# Altium project STM32_min.PrjPcb
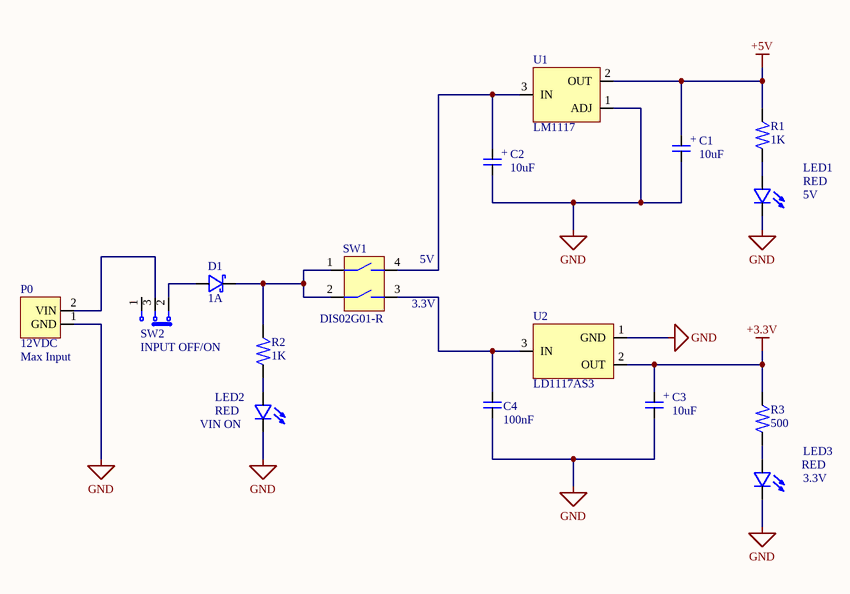
[diagram p0: STM32_Input.SchDoc]
5 sheets, 66 parts. Net scope: flat (ports and power ports of the same name join across sheets).
Board file: STM32_min.PcbDoc
Sheets:
  STM32_Input.SchDoc
  STM32_min.SchDoc
  STM32_Lvl-Shft_MCU.SchDoc
  STM32_Lvl-Shft_HUB75.SchDoc
  STM32_IO.SchDoc

## Sheet STM32_Input.SchDoc
size A; SheetNumber: 1; SheetTotal: 5

### Parts
C1  10uF  [SMT_CAP_EL_CHANG_VT1E100MC054000CE0]
C2  10uF  [SMT_CAP_EL_CHANG_VT1E100MC054000CE0]
C3  10uF  [SMT_CAP_EL_CHANG_VT1E100MC054000CE0]
C4  100nF  [SMT_CAP_1206(3216)_SAMSUNG]
D1  1A  [SMT_DIODE_SCHTKY_SMB_ONSEMI]
LED1  RED  [DIOM2012X18N]
LED2  RED  [DIOM2012X18N]
LED3  RED  [DIOM2012X18N]
P0  12VDC  [THT_CON_WAFER_2P_STRAIGHT_A2001WV2-2P]
R1  1K  [SMT_RES_0805(2012)]
R2  1K  [SMT_RES_0805(2012)]
R3  500  [SMT_RES_0805(2012)]
SW1  DIS02G01-R  [SMT_SWITCH_DIP_DIS02G01-R]
SW2  INPUT OFF/ON  [THT_SSW_ESP1010]
U1  LM1117  [SOT230P700X180-4N]
U2  LD1117AS3  [SMT_VR_LD1117AS3]

### Nets
+3.3V: C3.1 R3.2 U2.2(OUT)
+5V: C1.1 R1.2 U1.2(OUT)
GND: C1.2 C2.2 C3.2 C4.1 LED1.2 LED2.2 LED3.2 P0.1(GND) U1.1(ADJ) U2.1(GND)
NetC2_1: C2.1 SW1.4 U1.3(IN)
NetC4_2: C4.2 SW1.3 U2.3(IN)
NetD1_1: D1.1 SW2.2
NetD1_2: D1.2 R2.2 SW1.1 SW1.2
NetLED1_1: LED1.1 R1.1
NetLED2_1: LED2.1 R2.1
NetLED3_1: LED3.1 R3.1
NetP0_2: P0.2(VIN) SW2.3

Not connected (* = marked no-connect by the designer): SW2 1

### Notes on the sheet
- 5V
- (near SW1) 5V
- (near SW1) 3.3V
- (near P0) Max Input
- (near LED2) VIN ON
- 3.3V
- (in symbol SMT_CAP_EL_CHANG_VT1E100MC054000CE0) +

### Library data of the parts
C1-C3 = SMT_CAP_EL_CHANG_VT1E100MC054000CE0: SMT Capacitor Electrolytic 35V 10uF Pitch 1.3mm VT1E100MC054000CE0
C4 = SMT_CAP_1206(3216)_SAMSUNG: Ceramic Capacitor 1206(3216) Samsung CL31B104KBCNNNC 50VDC
D1 = SMT_DIODE_SCHTKY_SMB_ONSEMI: SMT Diode Schottky ONSEMI MODEL IF=1A VR=20V FV=0.6V MBRS120T3G
LED1-LED3 = SMT_LED_0805(2012): Led Diode 0805(2012) Cathode Mark, 20mA
P0 = THT_CON_WAFER_2P_STRAIGHT_A2001WV2-2P: Connector Wafer 2-Pins Pitch-2.0mm Straight Pins A2001WV2-2P
R1-R3 = SMT_RES_0805(2012): 0805(2012) Resistor 1/4-1/8W 150V 2A
SW1 = SMT_SWITCH_DIP_DIS02G01-R: DIP SMD Switch 2-Line 4-Pole 2.54Pitch Rating 25mA/24Vdc Height 0.70mm
SW2 = THT_SSW_ESP1010: Slide Switch ESP1010 12V 0.5A
U1 = LM1117_SOT-223: LM1117 SOT-223 5V HTC Voltage Regulator
U2 = SMT_VR_LD1117AS3: Voltage Regulator ST LD1117AS33TR 1A 3.3V 10Vmax

## Sheet STM32_min.SchDoc
size A; SheetNumber: 2; SheetTotal: 5
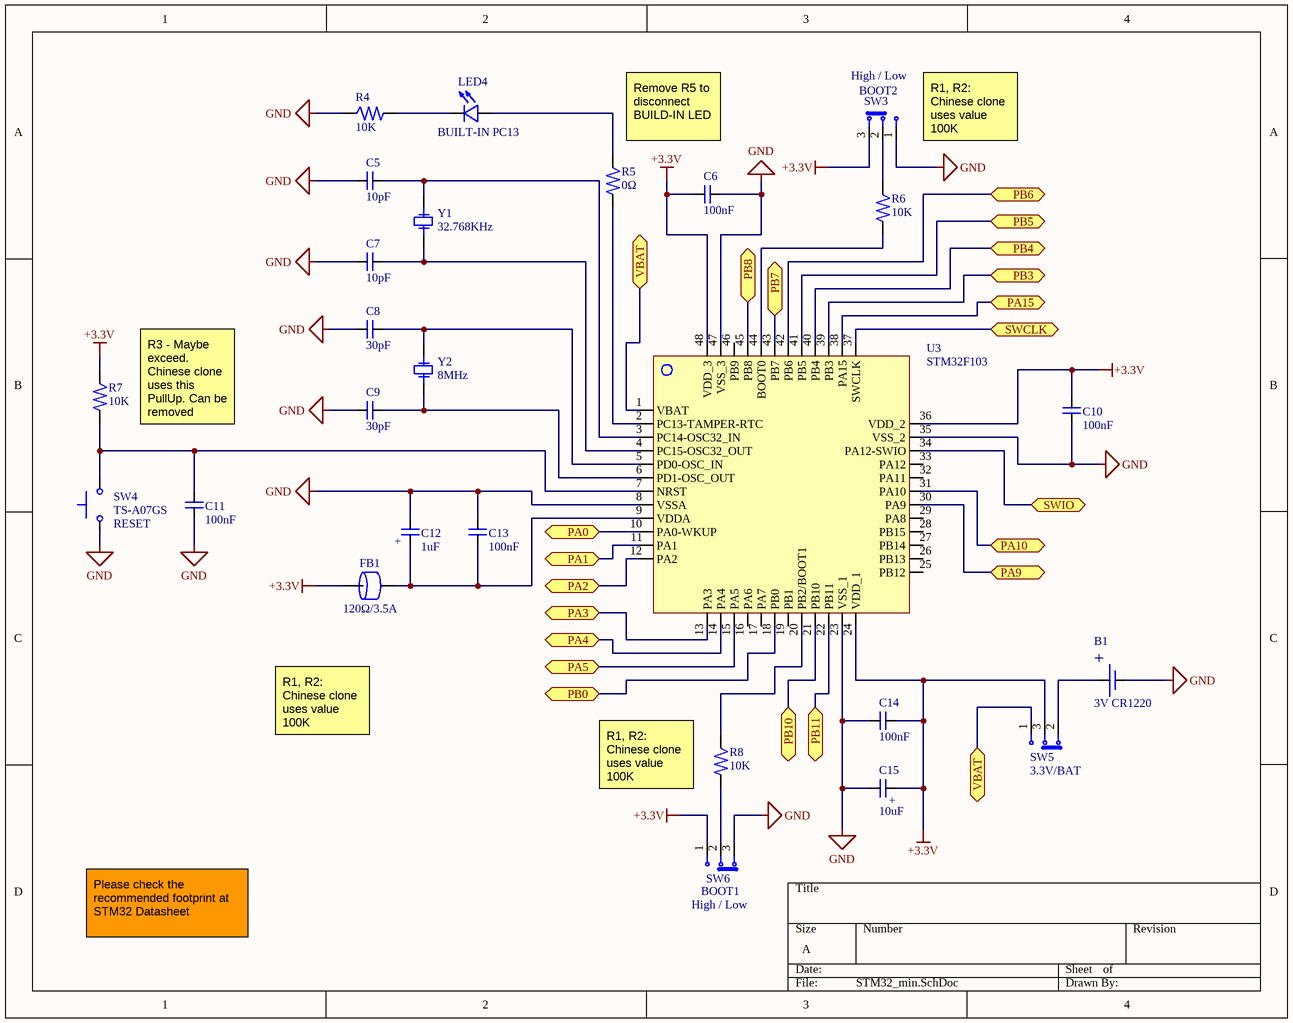
[diagram p1: STM32_min.SchDoc]

### Parts
B1  3V CR1220  [THT_BH-25T-GLD]
C5  10pF  [SMT_CAP_CER_MODEL_0805(2012)_SAMSUNG]
C6  100nF  [SMT_CAP_MODEL_1206(3216)_SAMSUNG]
C7  10pF  [SMT_CAP_CER_MODEL_0805(2012)_SAMSUNG]
C8  30pF  [SMT_CAP_MODEL_1206(3216)_SAMSUNG]
C9  30pF  [SMT_CAP_MODEL_1206(3216)_SAMSUNG]
C10  100nF  [SMT_CAP_MODEL_1206(3216)_SAMSUNG]
C11  100nF  [SMT_CAP_MODEL_1206(3216)_SAMSUNG]
C12  1uF  [SMT_CAP_TANT_MODEL_1206(3216)_KYOCERA]
C13  100nF  [SMT_CAP_MODEL_1206(3216)_SAMSUNG]
C14  100nF  [SMT_CAP_MODEL_1206(3216)_SAMSUNG]
C15  10uF  [SMT_CAP_TANT_MODEL_1210(3528)_KYOCERA]
FB1  120Ω/3.5A  [SMT_FERR_BEAD_MODEL_1206(3216)_MURATA]
LED4  BUILT-IN PC13  [DIOM2012X18N]
R4  10K  [SMT_RES_MODEL_1206(3216)_ROHM]
R5  0Ω  [SMT_RES_MODEL_1206(3216)_ROHM]
R6  10K  [SMT_RES_MODEL_1206(3216)_ROHM]
R7  10K  [SMT_RES_MODEL_1206(3216)_ROHM]
R8  10K  [SMT_RES_MODEL_1206(3216)_ROHM]
SW3  BOOT2  [SMT_SWW_SS-B90AP_DAWNING]
SW4  TS-A07GS  [SMT_TSW-A07GS]
SW5  3.3V/BAT  [THT_SSW_ESP1010]
SW6  BOOT1  [SMT_SWW_SS-B90AP_DAWNING]
U3  STM32F103  [SMT_IC_STM32F103]
Y1  32.768KHz  [SMT_XTAL_FC-135_EPSON]
Y2  8MHz  [SMT_XTAL_ATS08ASM-1E]

### Ports
PA0 (bidir), PA1 (bidir), PA2 (bidir), PA3 (bidir), PA4 (bidir), PA5 (bidir), PA9 (bidir), PA10 (bidir), PA15 (bidir), PB0 (bidir), PB3 (bidir), PB4 (bidir), PB5 (bidir), PB6 (bidir), PB7 (bidir), PB8 (bidir), PB10 (bidir), PB11 (bidir), SWCLK (bidir), SWIO (bidir), VBAT (bidir)

### Nets
+3.3V: C6.1 C10.1 C14.1 C15.1 FB1.1 R7.2 SW3.3 SW5.3 SW6.1 U3.24(VDD_1) U3.36(VDD_2) U3.48(VDD_3)
GND: B1.2(V-) C5.1 C6.2 C7.1 C8.1 C9.1 C10.2 C11.1 C12.2 C13.2 C14.2 C15.2 R4.2 SW3.1 SW4.1 SW6.3 U3.8(VSSA) U3.23(VSS_1) U3.35(VSS_2) U3.47(VSS_3)
NetB1_1: B1.1(V+) SW5.2
NetC5_2: C5.2 U3.3(PC14-OSC32_IN) Y1.2
NetC7_2: C7.2 U3.4(PC15-OSC32_OUT) Y1.1
NetC8_2: C8.2 U3.5(PD0-OSC_IN) Y2.2
NetC9_2: C9.2 U3.6(PD1-OSC_OUT) Y2.1
NetC11_2: C11.2 R7.1 SW4.2 U3.7(NRST)
NetC12_1: C12.1 C13.1 FB1.2 U3.9(VDDA)
NetIC1_1: U3.21(PB10) ; port PB10
NetIC1_3: U3.22(PB11) ; port PB11
NetIC1_4: U3.30(PA9) ; port PA9
NetIC1_5: U3.31(PA10) ; port PA10
NetIC2_1: U3.10(PA0-WKUP) ; port PA0
NetIC2_3: U3.12(PA2) ; port PA2
NetIC2_4: U3.13(PA3) ; port PA3
NetIC2_5: U3.15(PA5) ; port PA5
NetIC2_6: U3.42(PB6) ; port PB6
NetIC2_7: U3.40(PB4) ; port PB4
NetIC2_8: U3.38(PA15) ; port PA15
NetIC3_1: U3.18(PB0) ; port PB0
NetIC3_3: U3.11(PA1) ; port PA1
NetIC3_4: U3.14(PA4) ; port PA4
NetIC3_5: U3.45(PB8) ; port PB8
NetIC3_6: U3.41(PB5) ; port PB5
NetIC3_7: U3.39(PB3) ; port PB3
NetIC3_8: U3.43(PB7) ; port PB7
NetLED4_1: LED4.1 R5.2
NetLED4_2: LED4.2 R4.1
NetP3_2: U3.34(PA12-SWIO) ; port SWIO
NetP3_3: U3.37(SWCLK) ; port SWCLK
NetR5_1: R5.1 U3.2(PC13-TAMPER-RTC)
NetR6_1: R6.1 U3.44(BOOT0)
NetR6_2: R6.2 SW3.2
NetR8_1: R8.1 SW6.2
NetR8_2: R8.2 U3.20(PB2/BOOT1)
NetSW5_1: SW5.1 U3.1(VBAT) ; port VBAT

Not connected (* = marked no-connect by the designer): U3 16(PA6) 17(PA7) 19(PB1) 25(PB12) 26(PB13) 27(PB14) 28(PB15) 29(PA8) 32(PA11) 33(PA12) 46(PB9)

### Notes on the sheet
- (near SW3) High / Low
- (near R5) Remove R5 to disconnect BUILD-IN LED
- (near SW3) R1, R2: Chinese clone uses value 100K
- (near R7) R3 - Maybe exceed. Chinese clone uses this PullUp. Can be removed
- (near SW4) RESET
- R1, R2: Chinese clone uses value 100K
- (near R8) R1, R2: Chinese clone uses value 100K
- (near SW6) High / Low
- Please check the recommended footprint at STM32 Datasheet
- (in symbol SMT_CAP_TANT_MODEL_1206(3216)_KYOCERA) +
- (in symbol SMT_CAP_TANT_MODEL_1210(3528)_KYOCERA) +
- (in symbol THT_BH-25T-GLD) +

### Library data of the parts
B1 = THT_BH-25T-GLD: Battery Holder for CR-2032 Type Battery BH-25T-GLD
C5 C7 = SMT_CAP_CER_MODEL_0805(2012)_SAMSUNG: SMT SAMSUNG Ceramic Capacitor MODEL *V *pF 0805(2012) CL21C100DBANNNC(etc.)
C6 C8-C11 C13 C14 = SMT_CAP_MODEL_1206(3216)_SAMSUNG: SMT Samsung Ceramic Capacitor MODEL *V *nF 1206(3216)  CL31B104KBCNNNC(etc.)
C12 = SMT_CAP_TANT_MODEL_1206(3216)_KYOCERA: SMT KYOCERA Tantalum Capacitor MODEL *V *uF 1206(3216) EAN_3216-18 TAJA105M016RNJ(etc.)
C15 = SMT_CAP_TANT_MODEL_1210(3528)_KYOCERA: SMT KYOCERA Tantalum Capacitor MODEL *V *uF 1210(3528)  TAJB106K016RNJ(etc.)
FB1 = SMT_FERR_BEAD_MODEL_1206(3216)_MURATA: SMT MURATA Ferrite Bead MODEL 1206(3216) BLM31PG121SN1L *Ω/*mA
LED4 = SMT_LED_0805(2012): Led Diode 0805(2012) Cathode Mark, 20mA
R4-R8 = SMT_RES_MODEL_1206(3216)_ROHM: SMT ROHM Resistor MODEL 1206(3216) 1/4W MCR18ERTJ000
SW3 SW6 = SMT_SWW_SS-B90AP_DAWNING: Slide Switch SMD 12V 50mA 2-POS SS-B90AP-W-SP2-S085
SW4 = SMT_TSW-A07GS: Tactile Switch TS-A07GS 50mA 12V
SW5 = THT_SSW_ESP1010: Slide Switch ESP1010 12V 0.5A
U3 = SMT_IC_STM32F103: MCU STM32F103x8 LQFP48 pinout
Y1 = SMT_XTAL_FC-135_EPSON: SMD Quartz Crystal EPSON FC-135 12.5pF 32.768KHz ±20.0ppm
Y2 = SMT_XTAL_ATS08ASM-1E: SMD Quartz Crystal ATS08ASM-1E 20pF 8MHz

## Sheet STM32_Lvl-Shft_MCU.SchDoc
size A; SheetNumber: 3; SheetTotal: 5
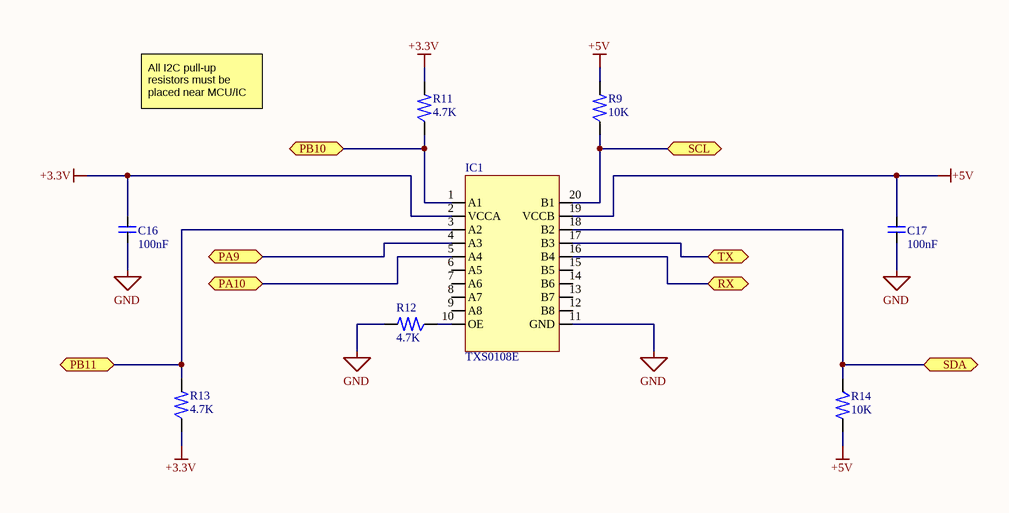
[diagram p2: STM32_Lvl-Shft_MCU.SchDoc]

### Parts
C16  100nF  [SMT_CAP_MODEL_1206(3216)_SAMSUNG]
C17  100nF  [SMT_CAP_MODEL_1206(3216)_SAMSUNG]
IC1  TXS0108E  [SMT_TXS0108E_IC]
R9  10K  [SMT_RES_MODEL_1206(3216)_ROHM]
R11  4.7K  [SMT_RES_MODEL_1206(3216)_ROHM]
R12  4.7K  [SMT_RES_MODEL_1206(3216)_ROHM]
R13  4.7K  [SMT_RES_MODEL_1206(3216)_ROHM]
R14  10K  [SMT_RES_MODEL_1206(3216)_ROHM]

### Ports
PA9 (bidir), PA10 (bidir), PB10 (bidir), PB11 (bidir), RX (bidir), SCL (bidir), SDA (bidir), TX (bidir)

### Nets
+3.3V: C16.1 IC1.2(VCCA) R11.1 R13.2
+5V: C17.1 IC1.19(VCCB) R9.1 R14.1
GND: C16.2 C17.2 IC1.11(GND) R12.1
NetIC1_1: IC1.1(A1) R11.2 ; port PB10
NetIC1_3: IC1.3(A2) R13.1 ; port PB11
NetIC1_4: IC1.4(A3) ; port PA9
NetIC1_5: IC1.5(A4) ; port PA10
NetIC1_10: IC1.10(OE) R12.2
NetIC1_16: IC1.16(B4) ; port RX
NetIC1_17: IC1.17(B3) ; port TX
NetIC1_18: IC1.18(B2) R14.2 ; port SDA
NetIC1_20: IC1.20(B1) R9.2 ; port SCL

Not connected (* = marked no-connect by the designer): IC1 6(A5) 7(A6) 8(A7) 9(A8) 12(B8) 13(B7) 14(B6) 15(B5)

### Notes on the sheet
- All I2C pull-up resistors must be placed near MCU/IC

### Library data of the parts
C16 C17 = SMT_CAP_MODEL_1206(3216)_SAMSUNG: as C6 on sheet STM32_min
IC1 = SMT_TXS0108E_IC: TXS0108E 8-BIT Bi-Directional Level Shifter 1.2-3.6V(A) 1.65-5.5V(B)
R9 R11-R14 = SMT_RES_MODEL_1206(3216)_ROHM: as R4 on sheet STM32_min

## Sheet STM32_Lvl-Shft_HUB75.SchDoc
size A; SheetNumber: 4; SheetTotal: 5
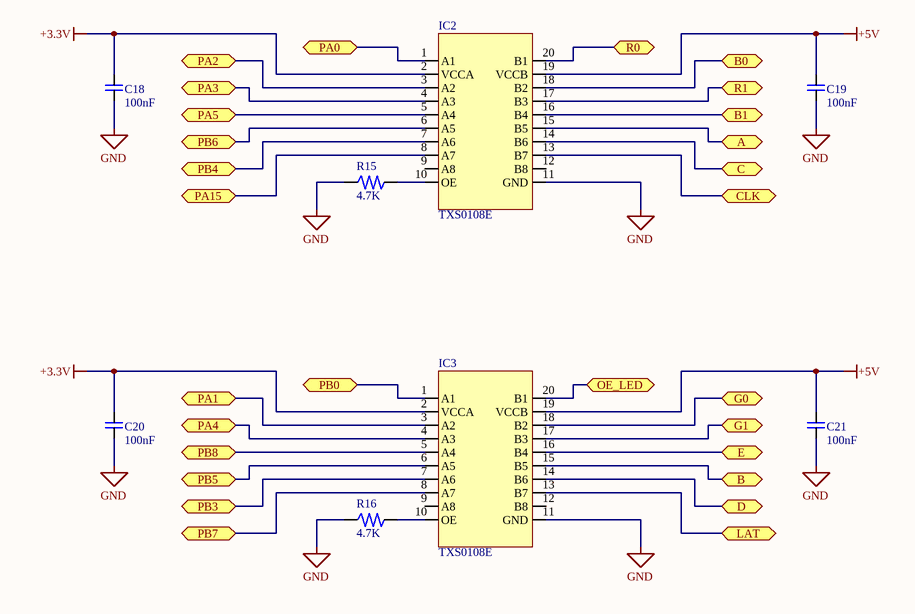
[diagram p3: STM32_Lvl-Shft_HUB75.SchDoc]

### Parts
C18  100nF  [SMT_CAP_MODEL_1206(3216)_SAMSUNG]
C19  100nF  [SMT_CAP_MODEL_1206(3216)_SAMSUNG]
C20  100nF  [SMT_CAP_MODEL_1206(3216)_SAMSUNG]
C21  100nF  [SMT_CAP_MODEL_1206(3216)_SAMSUNG]
IC2  TXS0108E  [SMT_TXS0108E_IC]
IC3  TXS0108E  [SMT_TXS0108E_IC]
R15  4.7K  [SMT_RES_MODEL_1206(3216)_ROHM]
R16  4.7K  [SMT_RES_MODEL_1206(3216)_ROHM]

### Ports
A (bidir), B0 (bidir), B1 (bidir), B (bidir), C (bidir), CLK (bidir), D (bidir), E (bidir), G0 (bidir), G1 (bidir), LAT (bidir), OE_LED (bidir), PA0 (bidir), PA1 (bidir), PA2 (bidir), PA3 (bidir), PA4 (bidir), PA5 (bidir), PA15 (bidir), PB0 (bidir), PB3 (bidir), PB4 (bidir), PB5 (bidir), PB6 (bidir), PB7 (bidir), PB8 (bidir), R0 (bidir), R1 (bidir)

### Nets
+3.3V: C18.1 C20.1 IC2.2(VCCA) IC3.2(VCCA)
+5V: C19.1 C21.1 IC2.19(VCCB) IC3.19(VCCB)
GND: C18.2 C19.2 C20.2 C21.2 IC2.11(GND) IC3.11(GND) R15.2 R16.2
NetIC2_1: IC2.1(A1) ; port PA0
NetIC2_3: IC2.3(A2) ; port PA2
NetIC2_4: IC2.4(A3) ; port PA3
NetIC2_5: IC2.5(A4) ; port PA5
NetIC2_6: IC2.6(A5) ; port PB6
NetIC2_7: IC2.7(A6) ; port PB4
NetIC2_8: IC2.8(A7) ; port PA15
NetIC2_10: IC2.10(OE) R15.1
NetIC2_13: IC2.13(B7) ; port CLK
NetIC2_14: IC2.14(B6) ; port C
NetIC2_15: IC2.15(B5) ; port A
NetIC2_16: IC2.16(B4) ; port B1
NetIC2_17: IC2.17(B3) ; port R1
NetIC2_18: IC2.18(B2) ; port B0
NetIC2_20: IC2.20(B1) ; port R0
NetIC3_1: IC3.1(A1) ; port PB0
NetIC3_3: IC3.3(A2) ; port PA1
NetIC3_4: IC3.4(A3) ; port PA4
NetIC3_5: IC3.5(A4) ; port PB8
NetIC3_6: IC3.6(A5) ; port PB5
NetIC3_7: IC3.7(A6) ; port PB3
NetIC3_8: IC3.8(A7) ; port PB7
NetIC3_10: IC3.10(OE) R16.1
NetIC3_13: IC3.13(B7) ; port LAT
NetIC3_14: IC3.14(B6) ; port D
NetIC3_15: IC3.15(B5) ; port B
NetIC3_16: IC3.16(B4) ; port E
NetIC3_17: IC3.17(B3) ; port G1
NetIC3_18: IC3.18(B2) ; port G0
NetIC3_20: IC3.20(B1) ; port OE_LED

Not connected (* = marked no-connect by the designer): IC2 9(A8) 12(B8); IC3 9(A8) 12(B8)

### Library data of the parts
C18-C21 = SMT_CAP_MODEL_1206(3216)_SAMSUNG: as C6 on sheet STM32_min
IC2 IC3 = SMT_TXS0108E_IC: as IC1 on sheet STM32_Lvl-Shft_MCU
R15 R16 = SMT_RES_MODEL_1206(3216)_ROHM: as R4 on sheet STM32_min

## Sheet STM32_IO.SchDoc
size A; SheetNumber: 5; SheetTotal: 5
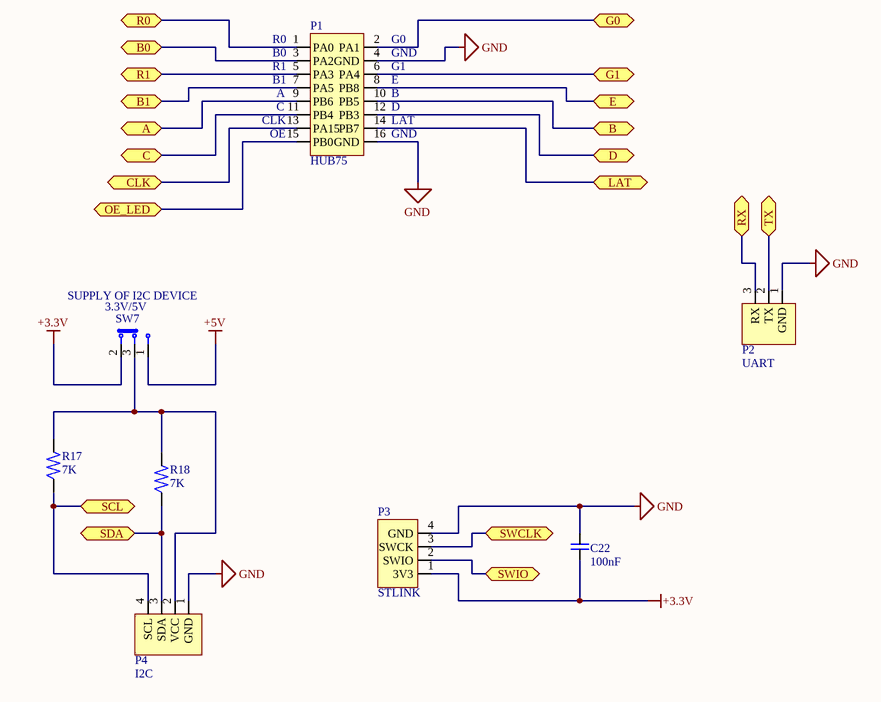
[diagram p4: STM32_IO.SchDoc]

### Parts
C22  100nF  [SMT_CAP_MODEL_1206(3216)_SAMSUNG]
P1  HUB75  [THT_CON_2316S-16G]
P2  UART  [SMT_CON_STRAIGHT_2417SJ-03-SM2]
P3  STLINK  [THT_STLINK_HEADER_4P_MALE]
P4  I2C  [SMT_CON_STRAIGHT_2417SJ-04-SM2]
R17  7K  [SMT_RES_MODEL_1206(3216)_ROHM]
R18  7K  [SMT_RES_MODEL_1206(3216)_ROHM]
SW7  3.3V/5V  [THT_SSW_ESP1010]

### Ports
A (bidir), B0 (bidir), B1 (bidir), B (bidir), C (bidir), CLK (bidir), D (bidir), E (bidir), G0 (bidir), G1 (bidir), LAT (bidir), OE_LED (bidir), R0 (bidir), R1 (bidir), RX (bidir), SCL (bidir), SDA (bidir), SWCLK (bidir), SWIO (bidir), TX (bidir)

### Nets
+3.3V: C22.1 P3.1(3V3) SW7.2
+5V: SW7.1
GND: C22.2 P1.4(GND) P1.16(GND) P2.1(GND) P3.4(GND) P4.1(GND)
NetIC1_16: P2.3(RX) ; port RX
NetIC1_17: P2.2(TX) ; port TX
NetIC1_18: P4.3(SDA) R18.2 ; port SDA
NetIC1_20: P4.4(SCL) R17.2 ; port SCL
NetIC2_13: P1.13(PA15) ; port CLK
NetIC2_14: P1.11(PB4) ; port C
NetIC2_15: P1.9(PB6) ; port A
NetIC2_16: P1.7(PA5) ; port B1
NetIC2_17: P1.5(PA3) ; port R1
NetIC2_18: P1.3(PA2) ; port B0
NetIC2_20: P1.1(PA0) ; port R0
NetIC3_13: P1.14(PB7) ; port LAT
NetIC3_14: P1.12(PB3) ; port D
NetIC3_15: P1.10(PB5) ; port B
NetIC3_16: P1.8(PB8) ; port E
NetIC3_17: P1.6(PA4) ; port G1
NetIC3_18: P1.2(PA1) ; port G0
NetIC3_20: P1.15(PB0) ; port OE_LED
NetP3_2: P3.2(SWIO) ; port SWIO
NetP3_3: P3.3(SWCK) ; port SWCLK
NetP4_2: P4.2(VCC) R17.1 R18.1 SW7.3

### Notes on the sheet
- (near P1) R0
- (near P1) B0
- (near P1) R1
- (near P1) B1
- (near P1) G0
- (near P1) GND
- (near P1) G1
- (near P1) E
- (near P1) CLK
- (near P1) OE
- (near P1) A
- (near P1) C
- (near P1) B
- (near P1) D
- (near P1) LAT
- (near SW7) SUPPLY OF I2C DEVICE

### Library data of the parts
C22 = SMT_CAP_MODEL_1206(3216)_SAMSUNG: as C6 on sheet STM32_min
P1 = THT_CON_2316S-16G: Connector 2316S-16G 16 Pin 2.54 Pitch
P2 = SMT_CON_STRAIGHT_2417SJ-03-SM2: Connector 3P NELTRON 2417SJ-03-SM2-CR 100V/2A 2.0mm Pitch SMT
P3 = THT_STLINK_HEADER_4P_MALE: Dupont Header Male STLINK 4P 2.54 Pitch
P4 = SMT_CON_STRAIGHT_2417SJ-04-SM2: Connector 4P NELTRON 2417SJ-04-SM2-CR 100V/2A 2.0mm Pitch SMT
R17 R18 = SMT_RES_MODEL_1206(3216)_ROHM: as R4 on sheet STM32_min
SW7 = THT_SSW_ESP1010: Slide Switch ESP1010 12V 0.5A

## Nets that join several sheets
+3.3V: STM32_Input (C3.1 R3.2 U2.2), STM32_min (12 pins), STM32_Lvl-Shft_MCU (C16.1 IC1.2 R11.1 R13.2), STM32_Lvl-Shft_HUB75 (C18.1 C20.1 IC2.2 IC3.2), STM32_IO (C22.1 P3.1 SW7.2)
+5V: STM32_Input (C1.1 R1.2 U1.2), STM32_Lvl-Shft_MCU (C17.1 IC1.19 R9.1 R14.1), STM32_Lvl-Shft_HUB75 (C19.1 C21.1 IC2.19 IC3.19), STM32_IO (SW7.1)
GND: STM32_Input (10 pins), STM32_min (20 pins), STM32_Lvl-Shft_MCU (C16.2 C17.2 IC1.11 R12.1), STM32_Lvl-Shft_HUB75 (8 pins), STM32_IO (6 pins)
NetIC1_1: STM32_min (U3.21), STM32_Lvl-Shft_MCU (IC1.1 R11.2)
NetIC1_3: STM32_min (U3.22), STM32_Lvl-Shft_MCU (IC1.3 R13.1)
NetIC1_4: STM32_min (U3.30), STM32_Lvl-Shft_MCU (IC1.4)
NetIC1_5: STM32_min (U3.31), STM32_Lvl-Shft_MCU (IC1.5)
NetIC1_16: STM32_Lvl-Shft_MCU (IC1.16), STM32_IO (P2.3)
NetIC1_17: STM32_Lvl-Shft_MCU (IC1.17), STM32_IO (P2.2)
NetIC1_18: STM32_Lvl-Shft_MCU (IC1.18 R14.2), STM32_IO (P4.3 R18.2)
NetIC1_20: STM32_Lvl-Shft_MCU (IC1.20 R9.2), STM32_IO (P4.4 R17.2)
NetIC2_1: STM32_min (U3.10), STM32_Lvl-Shft_HUB75 (IC2.1)
NetIC2_3: STM32_min (U3.12), STM32_Lvl-Shft_HUB75 (IC2.3)
NetIC2_4: STM32_min (U3.13), STM32_Lvl-Shft_HUB75 (IC2.4)
NetIC2_5: STM32_min (U3.15), STM32_Lvl-Shft_HUB75 (IC2.5)
NetIC2_6: STM32_min (U3.42), STM32_Lvl-Shft_HUB75 (IC2.6)
NetIC2_7: STM32_min (U3.40), STM32_Lvl-Shft_HUB75 (IC2.7)
NetIC2_8: STM32_min (U3.38), STM32_Lvl-Shft_HUB75 (IC2.8)
NetIC2_13: STM32_Lvl-Shft_HUB75 (IC2.13), STM32_IO (P1.13)
NetIC2_14: STM32_Lvl-Shft_HUB75 (IC2.14), STM32_IO (P1.11)
NetIC2_15: STM32_Lvl-Shft_HUB75 (IC2.15), STM32_IO (P1.9)
NetIC2_16: STM32_Lvl-Shft_HUB75 (IC2.16), STM32_IO (P1.7)
NetIC2_17: STM32_Lvl-Shft_HUB75 (IC2.17), STM32_IO (P1.5)
NetIC2_18: STM32_Lvl-Shft_HUB75 (IC2.18), STM32_IO (P1.3)
NetIC2_20: STM32_Lvl-Shft_HUB75 (IC2.20), STM32_IO (P1.1)
NetIC3_1: STM32_min (U3.18), STM32_Lvl-Shft_HUB75 (IC3.1)
NetIC3_3: STM32_min (U3.11), STM32_Lvl-Shft_HUB75 (IC3.3)
NetIC3_4: STM32_min (U3.14), STM32_Lvl-Shft_HUB75 (IC3.4)
NetIC3_5: STM32_min (U3.45), STM32_Lvl-Shft_HUB75 (IC3.5)
NetIC3_6: STM32_min (U3.41), STM32_Lvl-Shft_HUB75 (IC3.6)
NetIC3_7: STM32_min (U3.39), STM32_Lvl-Shft_HUB75 (IC3.7)
NetIC3_8: STM32_min (U3.43), STM32_Lvl-Shft_HUB75 (IC3.8)
NetIC3_13: STM32_Lvl-Shft_HUB75 (IC3.13), STM32_IO (P1.14)
NetIC3_14: STM32_Lvl-Shft_HUB75 (IC3.14), STM32_IO (P1.12)
NetIC3_15: STM32_Lvl-Shft_HUB75 (IC3.15), STM32_IO (P1.10)
NetIC3_16: STM32_Lvl-Shft_HUB75 (IC3.16), STM32_IO (P1.8)
NetIC3_17: STM32_Lvl-Shft_HUB75 (IC3.17), STM32_IO (P1.6)
NetIC3_18: STM32_Lvl-Shft_HUB75 (IC3.18), STM32_IO (P1.2)
NetIC3_20: STM32_Lvl-Shft_HUB75 (IC3.20), STM32_IO (P1.15)
NetP3_2: STM32_min (U3.34), STM32_IO (P3.2)
NetP3_3: STM32_min (U3.37), STM32_IO (P3.3)